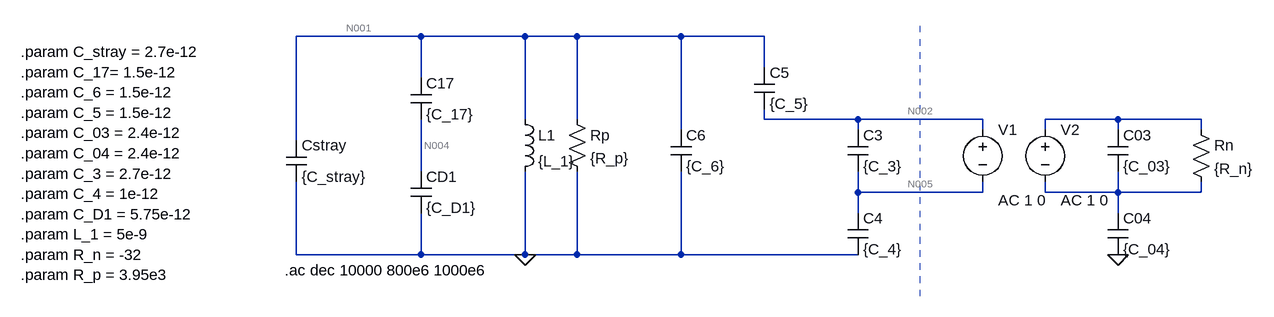
[diagram p0: schematic Modelo_eléctrico_medicion.asc]
Modelo_eléctrico_medicion.asc, the LTspice schematic file:
Version 4
SHEET 1 1536 680
WIRE 128 -32 -64 -32
WIRE 288 -32 128 -32
WIRE 368 -32 288 -32
WIRE 528 -32 368 -32
WIRE 656 -32 528 -32
WIRE 656 16 656 -32
WIRE 128 32 128 -32
WIRE 288 96 288 -32
WIRE 368 96 368 -32
WIRE 656 96 656 80
WIRE 800 96 656 96
WIRE 992 96 800 96
WIRE 1200 96 1088 96
WIRE 1328 96 1200 96
WIRE 528 112 528 -32
WIRE 800 112 800 96
WIRE 992 112 992 96
WIRE 1088 112 1088 96
WIRE 1200 112 1200 96
WIRE 1328 112 1328 96
WIRE -64 128 -64 -32
WIRE 128 176 128 96
WIRE 800 208 800 176
WIRE 992 208 992 192
WIRE 992 208 800 208
WIRE 1088 208 1088 192
WIRE 1200 208 1200 176
WIRE 1200 208 1088 208
WIRE 1328 208 1328 192
WIRE 1328 208 1200 208
WIRE 800 240 800 208
WIRE 1200 240 1200 208
WIRE -64 304 -64 192
WIRE 128 304 128 240
WIRE 128 304 -64 304
WIRE 288 304 288 176
WIRE 288 304 128 304
WIRE 368 304 368 176
WIRE 368 304 288 304
WIRE 528 304 528 176
WIRE 528 304 368 304
WIRE 800 304 528 304
FLAG 1200 304 0
FLAG 288 304 0
SYMBOL cap -80 128 R0
SYMATTR InstName Cstray
SYMATTR Value {C_stray}
SYMBOL cap 112 32 R0
SYMATTR InstName C17
SYMATTR Value {C_17}
SYMBOL cap 112 176 R0
SYMATTR InstName CD1
SYMATTR Value {C_D1}
SYMBOL ind 272 80 R0
SYMATTR InstName L1
SYMATTR Value {L_1}
SYMBOL res 352 80 R0
SYMATTR InstName Rp
SYMATTR Value {R_p}
SYMBOL cap 512 112 R0
SYMATTR InstName C6
SYMATTR Value {C_6}
SYMBOL cap 640 16 R0
SYMATTR InstName C5
SYMATTR Value {C_5}
SYMBOL cap 784 112 R0
SYMATTR InstName C3
SYMATTR Value {C_3}
SYMBOL cap 784 240 R0
SYMATTR InstName C4
SYMATTR Value {C_4}
SYMBOL cap 1184 112 R0
SYMATTR InstName C03
SYMATTR Value {C_03}
SYMBOL cap 1184 240 R0
SYMATTR InstName C04
SYMATTR Value {C_04}
SYMBOL res 1312 96 R0
SYMATTR InstName Rn
SYMATTR Value {R_n}
SYMBOL voltage 992 96 R0
WINDOW 123 24 124 Left 2
WINDOW 39 0 0 Left 0
SYMATTR InstName V1
SYMATTR Value ""
SYMATTR Value2 AC 1 0
SYMBOL voltage 1088 96 R0
WINDOW 123 24 124 Left 2
WINDOW 39 0 0 Left 0
SYMATTR InstName V2
SYMATTR Value ""
SYMATTR Value2 AC 1 0
TEXT -488 -8 Left 2 !.param C_stray = 2.7e-12\n.param C_17= 1.5e-12\n.param C_6 = 1.5e-12\n.param C_5 = 1.5e-12\n.param C_03 = 2.4e-12\n.param C_04 = 2.4e-12\n.param C_3 = 2.7e-12\n.param C_4 = 1e-12\n.param C_D1 = 5.75e-12\n.param L_1 = 5e-9\n.param R_n = -32\n.param R_p = 3.95e3
TEXT -82 328 Left 2 !.ac dec 10000 800e6 1000e6
LINE Normal 896 368 896 -48 2

The netlist it stands for:
* Modelo_eléctrico_medicion.asc
Cstray N001 0 {C_stray}
C17 N001 N004 {C_17}
CD1 N004 0 {C_D1}
L1 N001 0 {L_1}
Rp N001 0 {R_p}
C6 N001 0 {C_6}
C5 N001 N002 {C_5}
C3 N002 N005 {C_3}
C4 N005 0 {C_4}
C03 N003 N006 {C_03}
C04 N006 0 {C_04}
Rn N003 N006 {R_n}
V1 N002 N005 AC 1 0
V2 N003 N006 AC 1 0
.param C_stray = 2.7e-12
.param C_17= 1.5e-12
.param C_6 = 1.5e-12
.param C_5 = 1.5e-12
.param C_03 = 2.4e-12
.param C_04 = 2.4e-12
.param C_3 = 2.7e-12
.param C_4 = 1e-12
.param C_D1 = 5.75e-12
.param L_1 = 5e-9
.param R_n = -32
.param R_p = 3.95e3
.ac dec 10000 800e6 1000e6
.backanno
.end

* Results of the author's LTspice run, read from the files saved beside the schematic
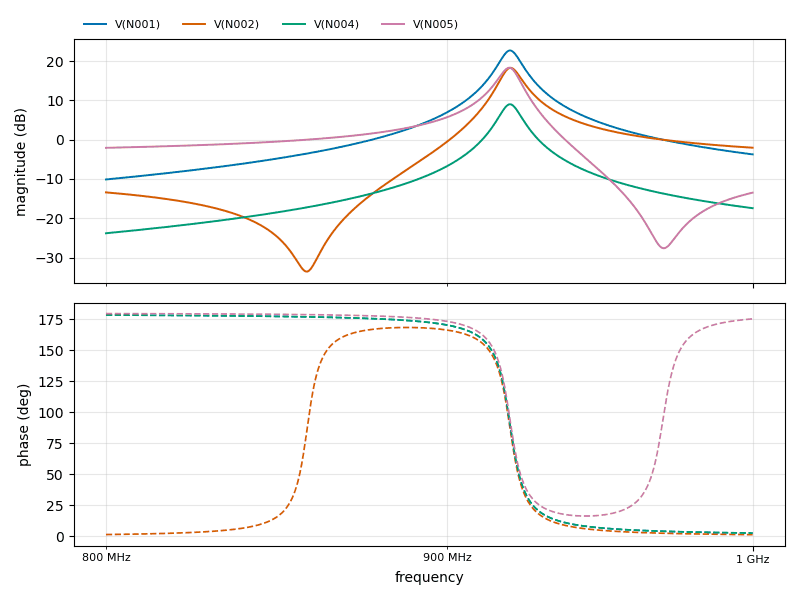
[diagram p1: AC Analysis of Modelo_eléctrico_medicion.asc, plotted from the saved traces]
* AC Analysis, 1 run:
*   V(N001): -10.13 dB at 800 MHz, -3.75 dB at 1 GHz, peak 22.69 dB at 919.8 MHz, 3 dB below the peak at 916.3 MHz and 923.1 MHz
*   V(N002): -13.42 dB at 800 MHz, -2.06 dB at 1 GHz, peak 18.27 dB at 919.8 MHz, 3 dB below the peak at 916.6 MHz and 923.4 MHz
*   V(N004): -23.82 dB at 800 MHz, -17.44 dB at 1 GHz, peak 9.00 dB at 919.8 MHz, 3 dB below the peak at 916.3 MHz and 923.1 MHz
*   V(N005): -2.08 dB at 800 MHz, -13.49 dB at 1 GHz, peak 18.30 dB at 919.4 MHz, 3 dB below the peak at 915.8 MHz and 922.6 MHz